# EAGLE board ClimbingWallController (EAGLE 6.4), part 1 of 2
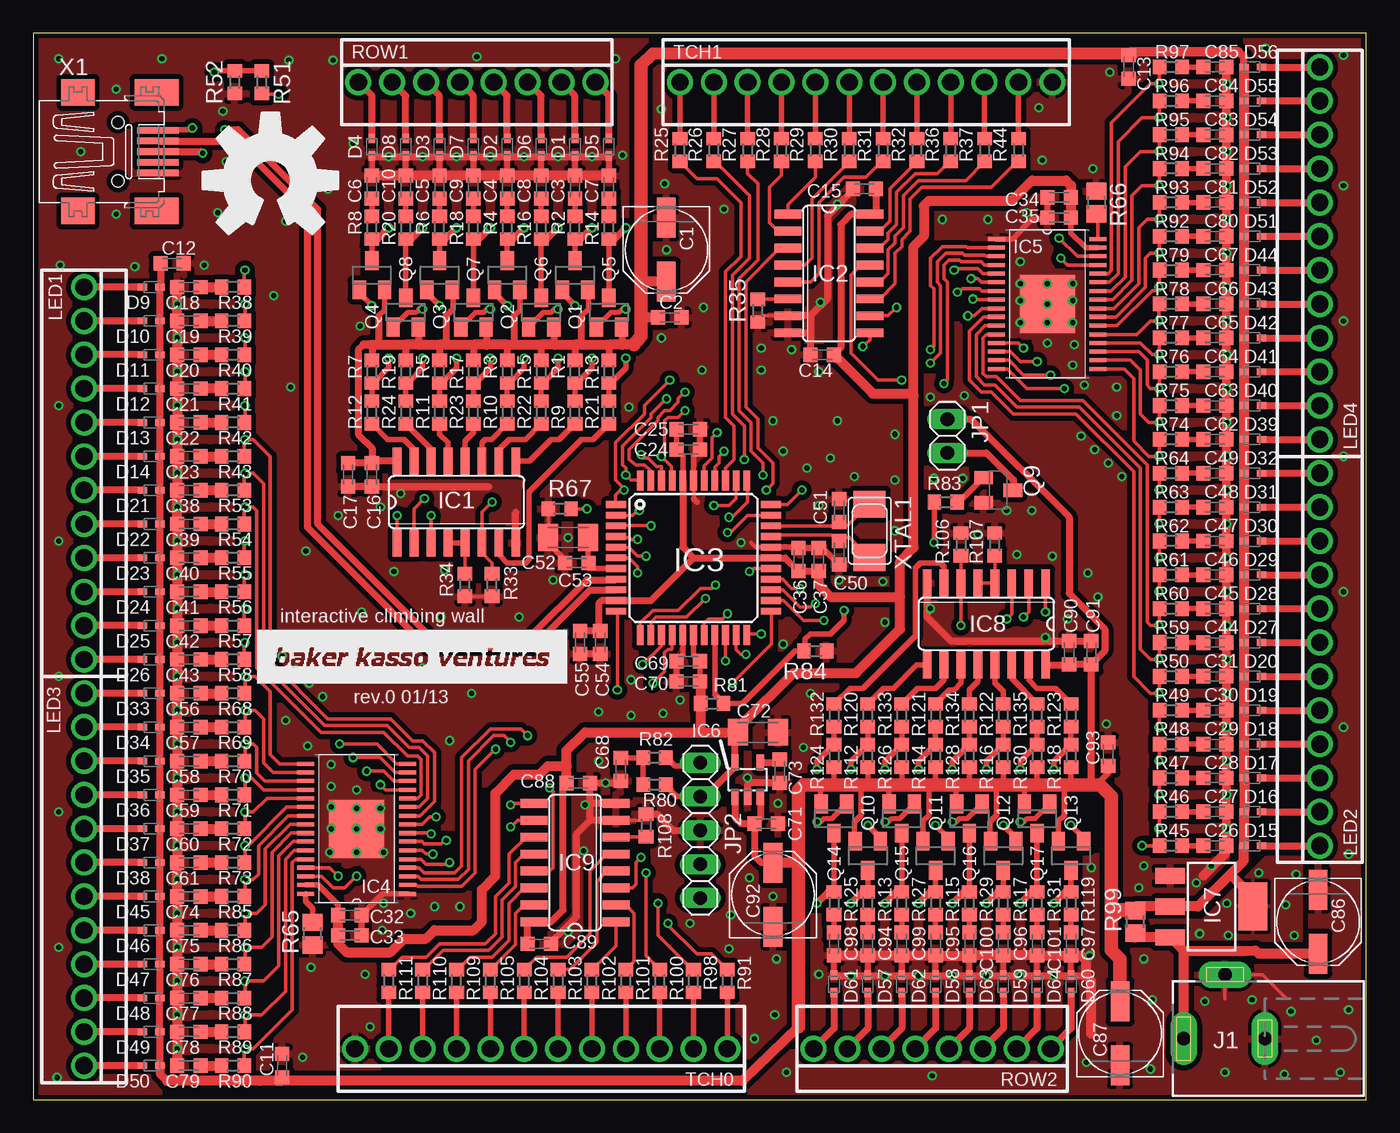
[diagram p1: board, top side]
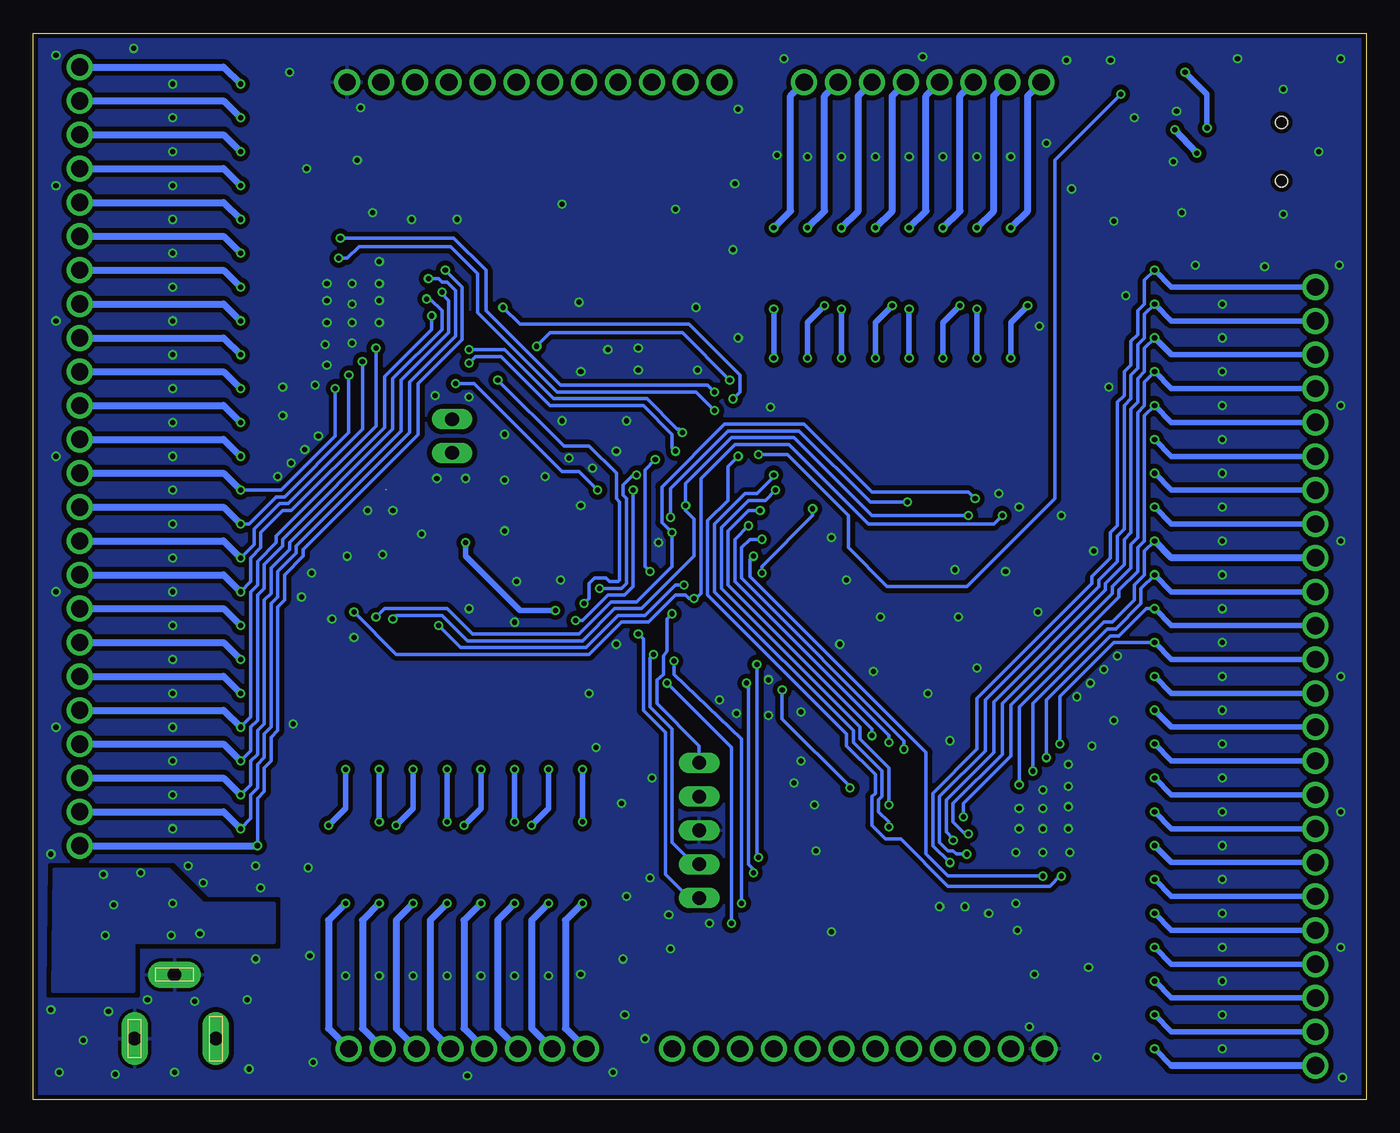
[diagram p2: board, bottom side, seen from below]

Size 100 x 80 mm. Coordinates in mm from the lower left corner, seen from the top.
Outline: 0,0 100,0 100,80 0,80 0,0
Copper layers (1*16): Top 0.035mm / dielectric 1.5mm / Bottom 0.035mm
Design rules "Seeed_Fusion_DR_v1.1": minimum track width 6mil, minimum drill 12mil, track to track 6mil, track to pad 6mil, pad to pad 6mil, via to via 6mil, smd to smd 0mil, copper to edge 10mil, drill to drill 10mil, minimum pad ring 10mil, minimum via ring 6mil, stop-mask expansion 2mil, vias tented up to drill 100mil, thermal gap 10mil

## Footprints (pad centres in the part's own frame; a part is rotated, then mirrored left to right if it is on the bottom)
PANASONIC_D = smd 3 x 1.4: + 2.4,0; - -2.4,0
C0603K = smd 1.05 x 1.08: 1 -0.875,0; 2 0.875,0
C1206K = smd 1.5 x 2: 1 -1.5,0; 2 1.5,0
SOD523 = smd 0.7 x 0.5: A 0.7,0; C -0.6,0
SO16 = smd 0.66 x 2.032: 1 -4.445,-3.073; 2 -3.175,-3.073; 3 -1.905,-3.073; 4 -0.635,-3.073; 5 0.635,-3.073; 6 1.905,-3.073; 7 3.175,-3.073; 8 4.445,-3.073; 9 4.445,3.073; 10 3.175,3.073; 11 1.905,3.073; 12 0.635,3.073; 13 -0.635,3.073; 14 -1.905,3.073; 15 -3.175,3.073; 16 -4.445,3.073
TQFP44 = smd 1.5 x 0.5: 1 -5.8,4; 2 -5.8,3.2; 3 -5.8,2.4; 4 -5.8,1.6; 5 -5.8,0.8; 6 -5.8,0; 7 -5.8,-0.8; 8 -5.8,-1.6; 9 -5.8,-2.4; 10 -5.8,-3.2; 11 -5.8,-4; 23 5.8,-4; 24 5.8,-3.2; 25 5.8,-2.4; 26 5.8,-1.6; 27 5.8,-0.8; 28 5.8,0; 29 5.8,0.8; 30 5.8,1.6; 31 5.8,2.4; 32 5.8,3.2; 33 5.8,4 | smd 0.5 x 1.5: 12 -4,-5.8; 13 -3.2,-5.8; 14 -2.4,-5.8; 15 -1.6,-5.8; 16 -0.8,-5.8; 17 0,-5.8; 18 0.8,-5.8; 19 1.6,-5.8; 20 2.4,-5.8; 21 3.2,-5.8; 22 4,-5.8; 34 4,5.8; 35 3.2,5.8; 36 2.4,5.8; 37 1.6,5.8; 38 0.8,5.8; 39 0,5.8; 40 -0.8,5.8; 41 -1.6,5.8; 42 -2.4,5.8; 43 -3.2,5.8; 44 -4,5.8
HTSSOP-32POWERPAD = smd 1.27 x 0.305: 1 -3.81,4.877; 2 -3.81,4.216; 3 -3.81,3.581; 5 -3.81,2.286; 6 -3.81,1.626; 7 -3.81,0.965; 8 -3.81,0.33; 9 -3.81,-0.33; 10 -3.81,-0.965; 11 -3.81,-1.626; 12 -3.81,-2.286; 13 -3.81,-2.921; 14 -3.81,-3.581; 15 -3.81,-4.216; 16 -3.81,-4.877; 17 3.81,-4.877; 18 3.81,-4.216; 19 3.81,-3.581; 20 3.81,-2.921; 21 3.81,-2.286; 22 3.81,-1.626; 23 3.81,-0.965; 24 3.81,-0.33; 25 3.81,0.33; 26 3.81,0.965; 27 3.81,1.626; 28 3.81,2.286; 29 3.81,2.921; 30 3.81,3.581; 31 3.81,4.216; 32 3.81,4.877; >VALUE -3.81,2.921 | smd 4.11 x 4.36: 33 0,0
SOT23-5L = smd 0.55 x 1.2: 1 -0.95,-1.3; 2 0,-1.3; 3 0.95,-1.3; 4 0.95,1.3; 5 -0.95,1.3
SOT223 = smd 1.219 x 2.235: 1 -2.311,-3.099; 2 0,-3.099; 3 2.311,-3.099 | smd 3.6 x 2.2: 4 0,3.099
DCJ0303 = drill 1 pad 2 long: 1 0,3.1; 2 4.8,0; 3 0,-3
1X02 = drill 1.016 long: 1 -1.27,0; 2 1.27,0
1X05 = drill 1.016 long: 1 -5.08,0; 2 -2.54,0; 3 0,0; 4 2.54,0; 5 5.08,0
OSTVN12 = drill 1.3: 1 -13.97,0; 2 -11.43,0; 3 -8.89,0; 4 -6.35,0; 5 -3.81,0; 6 -1.27,0; 7 1.27,0; 8 3.81,0; 9 6.35,0; 10 8.89,0; 11 11.43,0; 12 13.97,0
SOT23 = smd 1 x 1.4: 1 -0.95,-1.1; 2 0.95,-1.1; 3 0,1.1
SOT23-BEC = smd 1 x 1.4: B -0.95,-1.1; C 0,1.1; E 0.95,-1.1
R0603 = smd 1 x 1.1: 1 -0.85,0; 2 0.85,0
R0805 = smd 1.3 x 1.5: 1 -0.85,0; 2 0.85,0
OSTVN08 = drill 1.3: 1 -8.89,0; 2 -6.35,0; 3 -3.81,0; 4 -1.27,0; 5 1.27,0; 6 3.81,0; 7 6.35,0; 8 8.89,0
32005-201 = smd 3.1 x 0.5: 1 3,1.6; 2 3,0.8; 3 3,0; 4 3,-0.8; 5 3,-1.6 | smd 2.5 x 2: M1 -3,-4.45; M2 -3,4.45 | smd 3.3 x 2: M3 2.9,4.45; M4 2.9,-4.45 | hole 0.9: 0,2.2; 0,-2.2
NX5032 = smd 2 x 2.4: P$1 2,0; P$2 -2,0

## Placement (x,y rotation side)
C1  100uF  [PANASONIC_D]  47.5,63.75 270 top
C2  1uF  [C0603K]  47.75,58.67 0 top
C3  22n  [C0603K]  40.64,68.45 90 top
C4  22n  [C0603K]  35.56,68.45 90 top
C5  22n  [C0603K]  30.48,68.45 90 top
C6  22n  [C0603K]  25.4,68.45 90 top
C7  22n  [C0603K]  43.18,68.45 90 top
C8  22n  [C0603K]  38.1,68.45 90 top
C9  22n  [C0603K]  33.02,68.45 90 top
C10  22n  [C0603K]  27.94,68.45 90 top
C11  NC  [C0603K]  18.67,2.54 90 top
C12  NC  [C0603K]  10.41,62.74 0 top
C13  NC  [C0603K]  82.17,77.47 270 top
C14  0.1uF  [C0603K]  59.18,55.88 180 top
C15  NC  [C0603K]  62.36,68.33 180 top
C16  0.1uF  [C0603K]  25.4,46.86 270 top
C17  NC  [C0603K]  23.62,46.86 270 top
C18  1n  [C0603K]  11.68,60.96 180 top
C19  1n  [C0603K]  11.68,58.42 180 top
C20  1n  [C0603K]  11.68,55.88 180 top
C21  1n  [C0603K]  11.68,53.34 180 top
C22  1n  [C0603K]  11.68,50.8 180 top
C23  1n  [C0603K]  11.68,48.26 180 top
C24  0.1uF  [C0603K]  49.15,48.77 0 top
C25  NC  [C0603K]  49.15,50.29 0 top
C26  1n  [C0603K]  88.65,19.05 0 top
C27  1n  [C0603K]  88.65,21.59 0 top
C28  1n  [C0603K]  88.65,24.13 0 top
C29  1n  [C0603K]  88.65,26.67 0 top
C30  1n  [C0603K]  88.65,29.21 0 top
C31  1n  [C0603K]  88.65,31.75 0 top
C32  1uF  [C0603K]  23.75,13.84 0 top
C33  0.1uF  [C0603K]  23.75,12.32 0 top
C34  1uF  [C0603K]  76.96,67.69 180 top
C35  0.1uF  [C0603K]  76.96,66.17 180 top
C36  0.1uF  [C0603K]  57.4,40.51 90 top
C37  NC  [C0603K]  58.93,40.51 90 top
C38  1n  [C0603K]  11.68,45.72 180 top
C39  1n  [C0603K]  11.68,43.18 180 top
C40  1n  [C0603K]  11.68,40.64 180 top
C41  1n  [C0603K]  11.68,38.1 180 top
C42  1n  [C0603K]  11.68,35.56 180 top
C43  1n  [C0603K]  11.68,33.02 180 top
C44  1n  [C0603K]  88.65,34.29 0 top
C45  1n  [C0603K]  88.65,36.83 0 top
C46  1n  [C0603K]  88.65,39.37 0 top
C47  1n  [C0603K]  88.65,41.91 0 top
C48  1n  [C0603K]  88.65,44.45 0 top
C49  1n  [C0603K]  88.65,46.99 0 top
C50  NC  [C0603K]  60.45,41.02 270 top
C51  NC  [C0603K]  60.45,44.2 90 top
C52  10uF  [C1206K]  40.13,42.16 180 top
C53  NC  [C0603K]  40.77,40.26 180 top
C54  0.1uF  [C0603K]  42.55,34.29 270 top
C55  NC  [C0603K]  41.02,34.29 270 top
C56  1n  [C0603K]  11.68,30.48 180 top
C57  1n  [C0603K]  11.68,27.94 180 top
C58  1n  [C0603K]  11.68,25.4 180 top
C59  1n  [C0603K]  11.68,22.86 180 top
C60  1n  [C0603K]  11.68,20.32 180 top
C61  1n  [C0603K]  11.68,17.78 180 top
C62  1n  [C0603K]  88.65,49.53 0 top
C63  1n  [C0603K]  88.65,52.07 0 top
C64  1n  [C0603K]  88.65,54.61 0 top
C65  1n  [C0603K]  88.65,57.15 0 top
C66  1n  [C0603K]  88.65,59.69 0 top
C67  1n  [C0603K]  88.65,62.23 0 top
C68  NC  [C0603K]  44.07,24.77 270 top
C69  0.1uF  [C0603K]  49.15,32.89 180 top
C70  NC  [C0603K]  49.15,31.37 180 top
C71  1uF  [C0603K]  54.99,20.7 0 top
C72  10uF  [C1206K]  54.36,27.56 0 top
C73  470pF  [C0603K]  56.01,24.64 270 top
C74  1n  [C0603K]  11.68,15.24 180 top
C75  1n  [C0603K]  11.68,12.7 180 top
C76  1n  [C0603K]  11.68,10.16 180 top
C77  1n  [C0603K]  11.68,7.62 180 top
C78  1n  [C0603K]  11.68,5.08 180 top
C79  1n  [C0603K]  11.68,2.54 180 top
C80  1n  [C0603K]  88.65,64.77 0 top
C81  1n  [C0603K]  88.65,67.31 0 top
C82  1n  [C0603K]  88.65,69.85 0 top
C83  1n  [C0603K]  88.65,72.39 0 top
C84  1n  [C0603K]  88.65,74.93 0 top
C85  1n  [C0603K]  88.65,77.47 0 top
C86  100uF  [PANASONIC_D]  96.39,13.34 270 top
C87  100uF  [PANASONIC_D]  81.53,4.95 90 top
C88  0.1uF  [C0603K]  40.89,23.75 0 top
C89  NC  [C0603K]  37.97,11.68 0 top
C90  0.1uF  [C0603K]  77.72,33.53 90 top
C91  NC  [C0603K]  79.38,33.53 90 top
C92  100uF  [PANASONIC_D]  55.5,15.37 90 top
C93  1uF  [C0603K]  80.64,25.91 90 top
C94  22n  [C0603K]  62.61,11.68 270 top
C95  22n  [C0603K]  67.69,11.68 270 top
C96  22n  [C0603K]  72.77,11.68 270 top
C97  22n  [C0603K]  77.85,11.68 270 top
C98  22n  [C0603K]  60.07,11.68 270 top
C99  22n  [C0603K]  65.15,11.68 270 top
C100  22n  [C0603K]  70.23,11.68 270 top
C101  22n  [C0603K]  75.31,11.68 270 top
D1  RB521S30T1G  [SOD523]  40.64,71.5 270 top
D2  RB521S30T1G  [SOD523]  35.56,71.5 270 top
D3  RB521S30T1G  [SOD523]  30.48,71.5 270 top
D4  RB521S30T1G  [SOD523]  25.4,71.5 270 top
D5  RB521S30T1G  [SOD523]  43.18,71.5 270 top
D6  RB521S30T1G  [SOD523]  38.1,71.5 270 top
D7  RB521S30T1G  [SOD523]  33.02,71.5 270 top
D8  RB521S30T1G  [SOD523]  27.94,71.5 270 top
D9  NC  [SOD523]  8.89,60.96 180 top
D10  NC  [SOD523]  8.89,58.42 180 top
D11  NC  [SOD523]  8.89,55.88 180 top
D12  NC  [SOD523]  8.89,53.34 180 top
D13  NC  [SOD523]  8.89,50.8 180 top
D14  NC  [SOD523]  8.89,48.26 180 top
D15  NC  [SOD523]  91.44,19.05 0 top
D16  NC  [SOD523]  91.44,21.59 0 top
D17  NC  [SOD523]  91.44,24.13 0 top
D18  NC  [SOD523]  91.44,26.67 0 top
D19  NC  [SOD523]  91.44,29.21 0 top
D20  NC  [SOD523]  91.44,31.75 0 top
D21  NC  [SOD523]  8.89,45.72 180 top
D22  NC  [SOD523]  8.89,43.18 180 top
D23  NC  [SOD523]  8.89,40.64 180 top
D24  NC  [SOD523]  8.89,38.1 180 top
D25  NC  [SOD523]  8.89,35.56 180 top
D26  NC  [SOD523]  8.89,33.02 180 top
D27  NC  [SOD523]  91.44,34.29 0 top
D28  NC  [SOD523]  91.44,36.83 0 top
D29  NC  [SOD523]  91.44,39.37 0 top
D30  NC  [SOD523]  91.44,41.91 0 top
D31  NC  [SOD523]  91.44,44.45 0 top
D32  NC  [SOD523]  91.44,46.99 0 top
D33  NC  [SOD523]  8.89,30.48 180 top
D34  NC  [SOD523]  8.89,27.94 180 top
D35  NC  [SOD523]  8.89,25.4 180 top
D36  NC  [SOD523]  8.89,22.86 180 top
D37  NC  [SOD523]  8.89,20.32 180 top
D38  NC  [SOD523]  8.89,17.78 180 top
D39  NC  [SOD523]  91.44,49.53 0 top
D40  NC  [SOD523]  91.44,52.07 0 top
D41  NC  [SOD523]  91.44,54.61 0 top
D42  NC  [SOD523]  91.44,57.15 0 top
D43  NC  [SOD523]  91.44,59.69 0 top
D44  NC  [SOD523]  91.44,62.23 0 top
D45  NC  [SOD523]  8.89,15.24 180 top
D46  NC  [SOD523]  8.89,12.7 180 top
D47  NC  [SOD523]  8.89,10.16 180 top
D48  NC  [SOD523]  8.89,7.62 180 top
D49  NC  [SOD523]  8.89,5.08 180 top
D50  NC  [SOD523]  8.89,2.54 180 top
D51  NC  [SOD523]  91.44,64.77 0 top
D52  NC  [SOD523]  91.44,67.31 0 top
D53  NC  [SOD523]  91.44,69.85 0 top
D54  NC  [SOD523]  91.44,72.39 0 top
D55  NC  [SOD523]  91.44,74.93 0 top
D56  NC  [SOD523]  91.44,77.47 0 top
D57  RB521S30T1G  [SOD523]  62.61,8.64 90 top
D58  RB521S30T1G  [SOD523]  67.69,8.64 90 top
D59  RB521S30T1G  [SOD523]  72.77,8.64 90 top
D60  RB521S30T1G  [SOD523]  77.85,8.64 90 top
D61  RB521S30T1G  [SOD523]  60.07,8.64 90 top
D62  RB521S30T1G  [SOD523]  65.15,8.64 90 top
D63  RB521S30T1G  [SOD523]  70.23,8.64 90 top
D64  RB521S30T1G  [SOD523]  75.31,8.64 90 top
IC1  74HCT138D  [SO16]  31.75,44.83 0 top
IC2  SN74LV4052AD  [SO16]  59.69,61.98 270 top
IC3  PIC24FJ32GB004  [TQFP44]  49.53,40.64 0 top
IC4  TLC5952  [HTSSOP-32POWERPAD]  24.26,20.32 180 top
IC5  TLC5952  [HTSSOP-32POWERPAD]  76.07,59.69 0 top
IC6  TC1015  [SOT23-5L]  53.59,24 0 top
IC7  [SOT223]  88.39,14.48 270 top
IC8  74HCT138D  [SO16]  71.5,35.69 180 top
IC9  SN74LV4052AD  [SO16]  40.64,17.78 90 top
J1  PWR  [DCJ0303]  89.41,4.57 90 top
JP1  BUZZER  [1X02]  68.58,49.78 270 top
JP2  DEBUG  [1X05]  50.04,20.19 270 top
LED1  [OSTVN12]  3.81,46.99 270 top
LED2  [OSTVN12]  96.52,33.02 90 top
LED3  [OSTVN12]  3.81,16.51 270 top
LED4  [OSTVN12]  96.52,63.5 90 top
Q1  DPBT8105  [SOT23]  40.64,61.85 0 top
Q2  DPBT8105  [SOT23]  35.56,61.85 0 top
Q3  DPBT8105  [SOT23]  30.48,61.85 0 top
Q4  DPBT8105  [SOT23]  25.4,61.85 0 top
Q5  DPBT8105  [SOT23]  43.18,59.05 0 top
Q6  DPBT8105  [SOT23]  38.1,59.05 0 top
Q7  DPBT8105  [SOT23]  33.02,59.05 0 top
Q8  DPBT8105  [SOT23]  27.94,59.05 0 top
Q9  NC  [SOT23-BEC]  72.39,45.72 270 top
Q10  DPBT8105  [SOT23]  62.61,18.29 180 top
Q11  DPBT8105  [SOT23]  67.69,18.29 180 top
Q12  DPBT8105  [SOT23]  72.77,18.29 180 top
Q13  DPBT8105  [SOT23]  77.85,18.29 180 top
Q14  DPBT8105  [SOT23]  60.07,21.08 180 top
Q15  DPBT8105  [SOT23]  65.15,21.08 180 top
Q16  DPBT8105  [SOT23]  70.23,21.08 180 top
Q17  DPBT8105  [SOT23]  75.31,21.08 180 top
R1  NC  [R0603]  40.64,54.61 270 top
R2  20  [R0603]  40.64,65.41 270 top
R3  NC  [R0603]  35.56,54.61 270 top
R4  20  [R0603]  35.56,65.41 270 top
R5  NC  [R0603]  30.48,54.61 270 top
R6  20  [R0603]  30.48,65.41 270 top
R7  NC  [R0603]  25.4,54.61 270 top
R8  20  [R0603]  25.4,65.41 270 top
R9  750  [R0603]  40.64,51.56 90 top
R10  750  [R0603]  35.56,51.56 90 top
R11  750  [R0603]  30.48,51.56 90 top
R12  750  [R0603]  25.4,51.56 90 top
R13  NC  [R0603]  43.18,54.61 270 top
R14  20  [R0603]  43.18,65.41 270 top
R15  NC  [R0603]  38.1,54.61 270 top
R16  20  [R0603]  38.1,65.41 270 top
R17  NC  [R0603]  33.02,54.61 270 top
R18  20  [R0603]  33.02,65.41 270 top
R19  NC  [R0603]  27.94,54.61 270 top
R20  20  [R0603]  27.94,65.41 270 top
R21  750  [R0603]  43.18,51.56 90 top
R22  750  [R0603]  38.1,51.56 90 top
R23  750  [R0603]  33.02,51.56 90 top
R24  750  [R0603]  27.94,51.56 90 top
R25  390  [R0603]  48.51,71.25 90 top
R26  390  [R0603]  51.05,71.25 90 top
R27  390  [R0603]  53.59,71.25 90 top
R28  390  [R0603]  56.13,71.25 90 top
R29  390  [R0603]  58.67,71.25 90 top
R30  390  [R0603]  61.21,71.25 90 top
R31  390  [R0603]  63.75,71.25 90 top
R32  390  [R0603]  66.29,71.25 90 top
R33  4.7k  [R0603]  34.42,38.61 90 top
R34  4.7k  [R0603]  32.38,38.61 90 top
R35  4.7k  [R0603]  54.36,59.18 90 top
R36  390  [R0603]  68.83,71.25 90 top
R37  390  [R0603]  71.37,71.25 90 top
R38  300  [R0603]  14.99,60.96 0 top
R39  300  [R0603]  14.99,58.42 0 top
R40  300  [R0603]  14.99,55.88 0 top
R41  300  [R0603]  14.99,53.34 0 top
R42  300  [R0603]  14.99,50.8 0 top
R43  300  [R0603]  14.99,48.26 0 top
R44  390  [R0603]  73.91,71.25 90 top
R45  300  [R0603]  85.34,19.05 180 top
R46  300  [R0603]  85.34,21.59 180 top
R47  300  [R0603]  85.34,24.13 180 top
R48  300  [R0603]  85.34,26.67 180 top
R49  300  [R0603]  85.34,29.21 180 top
R50  300  [R0603]  85.34,31.75 180 top
R51  4.7k  [R0603]  17.14,76.33 270 top
R52  4.7k  [R0603]  15.11,76.33 90 top
R53  300  [R0603]  14.99,45.72 0 top
R54  300  [R0603]  14.99,43.18 0 top
R55  300  [R0603]  14.99,40.64 0 top
R56  300  [R0603]  14.99,38.1 0 top
R57  300  [R0603]  14.99,35.56 0 top
R58  300  [R0603]  14.99,33.02 0 top
R59  300  [R0603]  85.34,34.29 180 top
R60  300  [R0603]  85.34,36.83 180 top
R61  300  [R0603]  85.34,39.37 180 top
R62  300  [R0603]  85.34,41.91 180 top
R63  300  [R0603]  85.34,44.45 180 top
R64  300  [R0603]  85.34,46.99 180 top
R65  1.37k 0.5%  [R0805]  20.95,12.45 90 top
R66  1.37k 0.5%  [R0805]  79.76,67.31 270 top
R67  4.7k  [R0603]  39.5,44.32 0 top
R68  300  [R0603]  14.99,30.48 0 top
R69  300  [R0603]  14.99,27.94 0 top
R70  300  [R0603]  14.99,25.4 0 top
R71  300  [R0603]  14.99,22.86 0 top
R72  300  [R0603]  14.99,20.32 0 top
R73  300  [R0603]  14.99,17.78 0 top
R74  300  [R0603]  85.34,49.53 180 top
R75  300  [R0603]  85.34,52.07 180 top
R76  300  [R0603]  85.34,54.61 180 top
R77  300  [R0603]  85.34,57.15 180 top
R78  300  [R0603]  85.34,59.69 180 top
R79  300  [R0603]  85.34,62.23 180 top
R80  4.7k  [R0603]  46.61,23.62 0 top
R81  NC  [R0603]  50.93,29.72 180 top
R82  390  [R0603]  46.61,25.65 180 top
R83  NC  [R0603]  68.45,44.83 0 top
R84  NC  [R0603]  58.67,33.66 180 top
R85  300  [R0603]  14.99,15.24 0 top
R86  300  [R0603]  14.99,12.7 0 top
R87  300  [R0603]  14.99,10.16 0 top
R88  300  [R0603]  14.99,7.62 0 top
R89  300  [R0603]  14.99,5.08 0 top
R90  300  [R0603]  14.99,2.54 0 top
R91  390  [R0603]  52.07,8.89 270 top
R92  300  [R0603]  85.34,64.77 180 top
R93  300  [R0603]  85.34,67.31 180 top
R94  300  [R0603]  85.34,69.85 180 top
R95  300  [R0603]  85.34,72.39 180 top
R96  300  [R0603]  85.34,74.93 180 top
R97  300  [R0603]  85.34,77.47 180 top
R98  390  [R0603]  49.53,8.89 270 top
R99  0  [R0805]  82.68,13.34 90 top
R100  390  [R0603]  46.99,8.89 270 top
R101  390  [R0603]  44.45,8.89 270 top
R102  390  [R0603]  41.91,8.89 270 top
R103  390  [R0603]  39.37,8.89 270 top
R104  390  [R0603]  36.83,8.89 270 top
R105  390  [R0603]  34.29,8.89 270 top
R106  4.7k  [R0603]  69.6,41.66 270 top
R107  4.7k  [R0603]  72.14,41.66 270 top
R108  4.7k  [R0603]  45.97,20.57 270 top
R109  390  [R0603]  31.75,8.89 270 top
R110  390  [R0603]  29.21,8.89 270 top
R111  390  [R0603]  26.67,8.89 270 top
R112  NC  [R0603]  62.61,25.78 90 top
R113  20  [R0603]  62.61,14.73 90 top
R114  NC  [R0603]  67.69,25.78 90 top
R115  20  [R0603]  67.69,14.73 90 top
R116  NC  [R0603]  72.77,25.78 90 top
R117  20  [R0603]  72.77,14.73 90 top
R118  NC  [R0603]  77.85,25.78 90 top
R119  20  [R0603]  77.85,14.73 90 top
R120  750  [R0603]  62.61,28.83 270 top
R121  750  [R0603]  67.69,28.83 270 top
R122  750  [R0603]  72.77,28.83 270 top
R123  750  [R0603]  77.85,28.83 270 top
R124  NC  [R0603]  60.07,25.78 90 top
R125  20  [R0603]  60.07,14.73 90 top
R126  NC  [R0603]  65.15,25.78 90 top
R127  20  [R0603]  65.15,14.73 90 top
R128  NC  [R0603]  70.23,25.78 90 top
R129  20  [R0603]  70.23,14.73 90 top
R130  NC  [R0603]  75.31,25.78 90 top
R131  20  [R0603]  75.31,14.73 90 top
R132  750  [R0603]  60.07,28.83 270 top
R133  750  [R0603]  65.15,28.83 270 top
R134  750  [R0603]  70.23,28.83 270 top
R135  750  [R0603]  75.31,28.83 270 top
ROW1  [OSTVN08]  33.27,76.33 0 top
ROW2  [OSTVN08]  67.44,3.81 180 top
TCH0  [OSTVN12]  38.1,3.81 180 top
TCH1  [OSTVN12]  62.48,76.33 0 top
X1  MINI-USB-32005-201  [32005-201]  6.35,71.12 0 top
XTAL1  NC  [NX5032]  62.74,42.67 270 top